# EAGLE design Buffered mult (EAGLE 7.5.0)
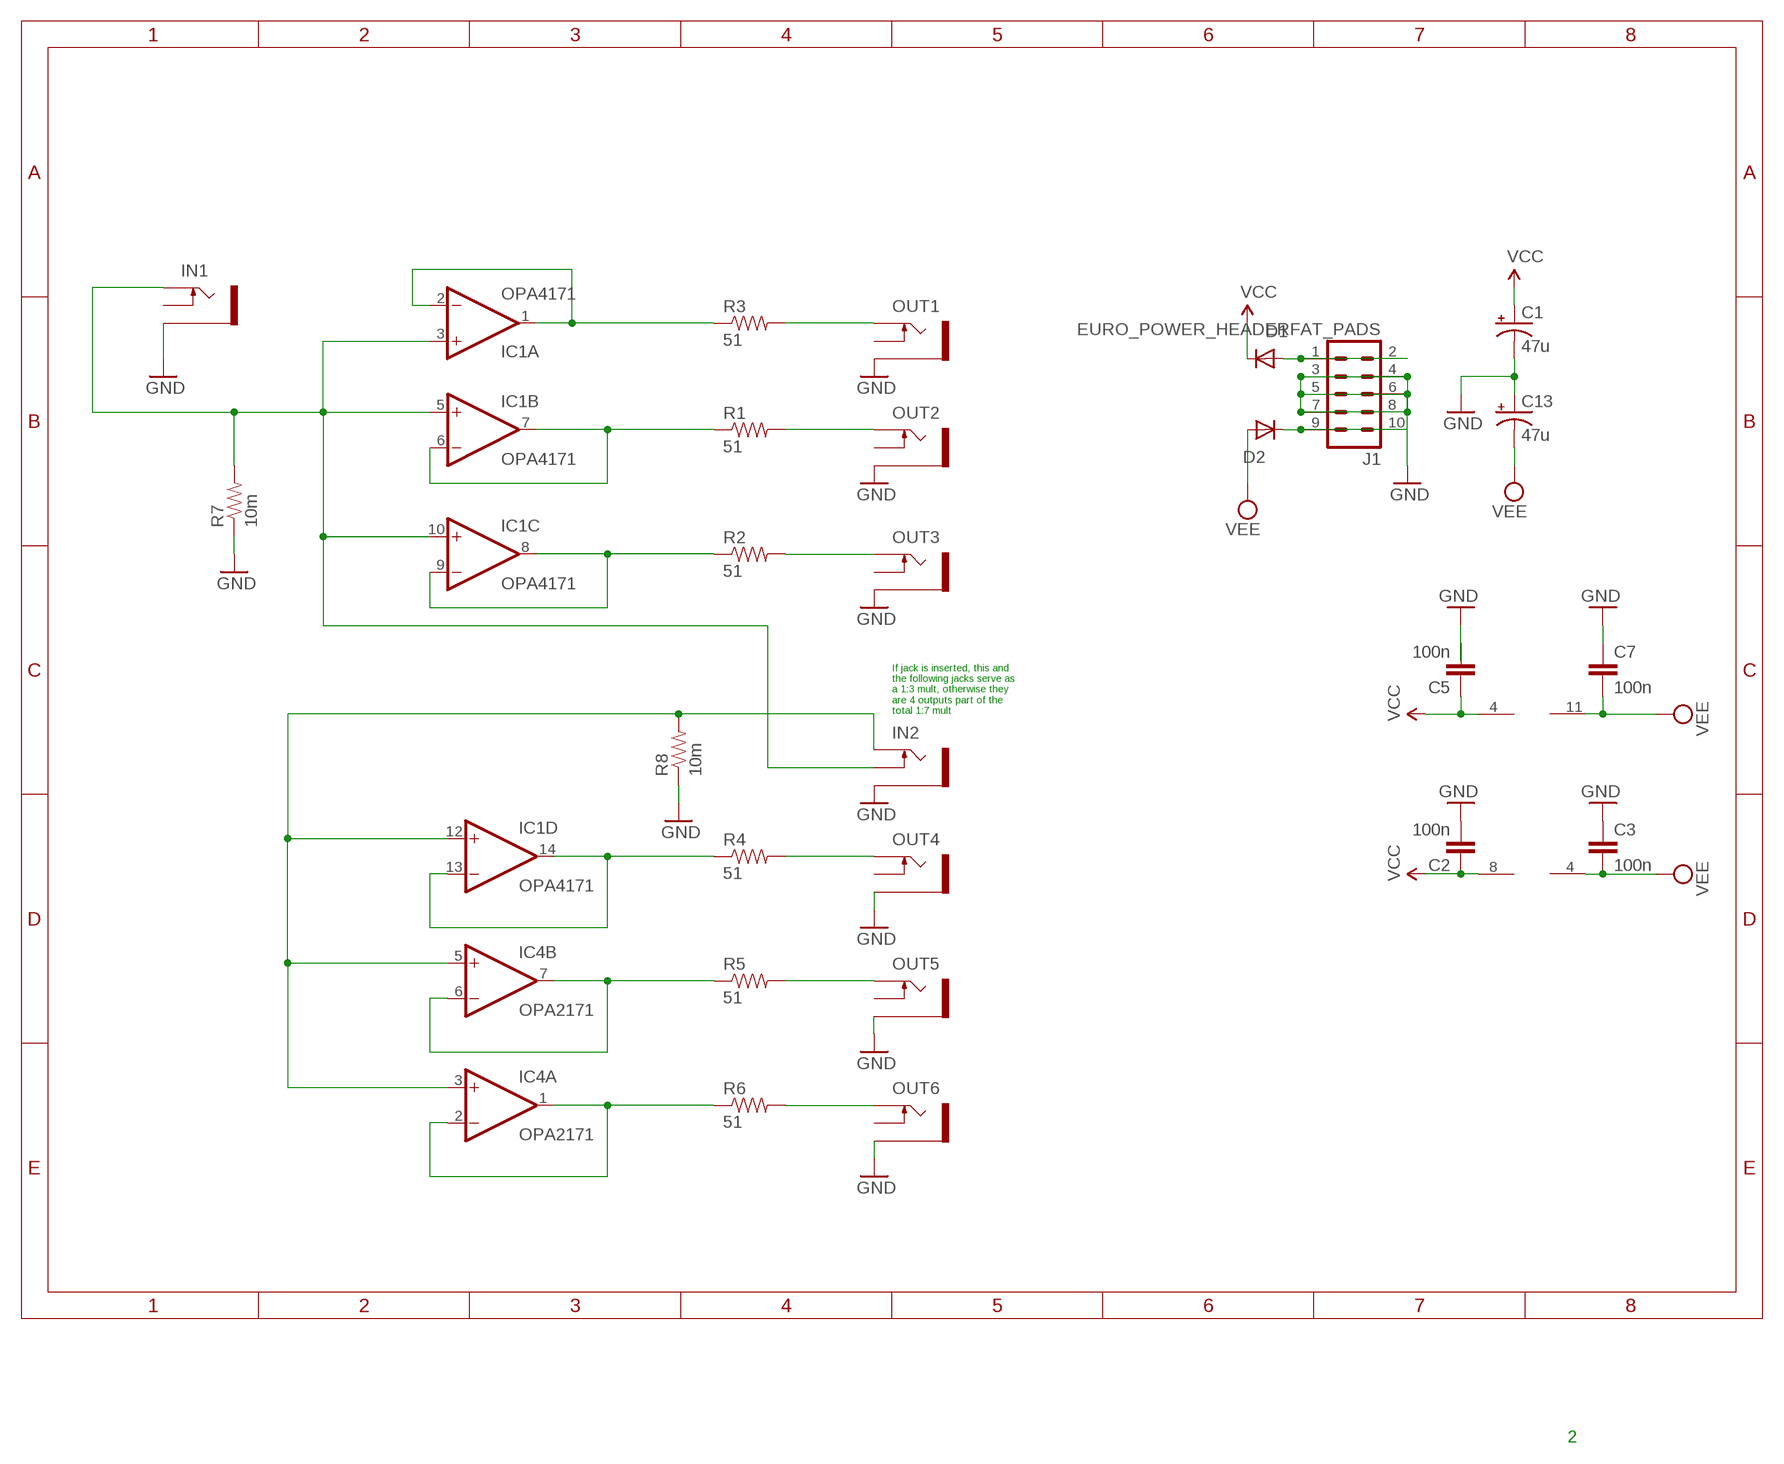
[diagram p0: schematic, sheet 1]

## Parts
C1  47u  CPOL-USD  [PANASONIC_D]
C2  100n  CAP1206  [1206]
C3  100n  CAP1206  [1206]
C5  100n  CAP1206  [1206]
C7  100n  CAP1206  [1206]
C13  47u  CPOL-USD  [PANASONIC_D]
D1  1N5819HW  DIODE-SOD123  [SOD123]
D2  1N5819HW  DIODE-SOD123  [SOD123]
IC1  OPA4171  TL074PW  [TSSOP14]
IC4  OPA2171  TL072D  [SO08]
IN1  PJ302M  [PJ302M]
IN2  PJ302M  [PJ302M]
J1  EURO_POWER_HEADERFAT_PADS  [EURO_PWR_HEADER_FAT]
OUT1  PJ302M  [PJ302M]
OUT2  PJ302M  [PJ302M]
OUT3  PJ302M  [PJ302M]
OUT4  PJ302M  [PJ302M]
OUT5  PJ302M  [PJ302M]
OUT6  PJ302M  [PJ302M]
R1  51  RESISTOR1206  [1206]
R2  51  RESISTOR1206  [1206]
R3  51  RESISTOR1206  [1206]
R4  51  RESISTOR1206  [1206]
R5  51  RESISTOR1206  [1206]
R6  51  RESISTOR1206  [1206]
R7  10m  RESISTOR1206  [1206]
R8  10m  RESISTOR1206  [1206]

## Nets
GND: C1.- C2.2 C3.1 C5.2 C7.1 C13.+ IN1.GND(SLEEVE) IN2.GND(SLEEVE) J1.3 J1.4 J1.5 J1.6 J1.7 J1.8 OUT1.GND(SLEEVE) OUT2.GND(SLEEVE) OUT3.GND(SLEEVE) OUT4.GND(SLEEVE) OUT5.GND(SLEEVE) OUT6.GND(SLEEVE) R7.1 R8.1
N$1: OUT6.TIP R6.2
N$2: IC1.1(A:OUT) IC1.2(A:-IN) R3.1
N$3: OUT5.TIP R5.2
N$4: OUT4.TIP R4.2
N$5: IC1.3(A:+IN) IC1.5(B:+IN) IC1.10(C:+IN) IN1.TIP IN2.SW(SWITCH) R7.2
N$6: IC1.8(C:OUT) IC1.9(C:-IN) R2.1
N$7: OUT2.TIP R1.2
N$8: OUT3.TIP R2.2
N$9: OUT1.TIP R3.2
N$10: IC1.6(B:-IN) IC1.7(B:OUT) R1.1
N$12: IC4.1(A:OUT) IC4.2(A:-IN) R6.1
N$13: IC4.6(B:-IN) IC4.7(B:OUT) R5.1
N$14: D2.C J1.9 J1.10
N$15: D1.A J1.1 J1.2
N$17: IC1.13(D:-IN) IC1.14(D:OUT) R4.1
N$19: IC1.12(D:+IN) IC4.3(A:+IN) IC4.5(B:+IN) IN2.TIP R8.2
VCC: C1.+ C2.1 C5.1 D1.C IC1.4(P:V+) IC4.8(P:V+)
VEE: C3.2 C7.2 C13.- D2.A IC1.11(P:V-) IC4.4(P:V-)
Unconnected: IN1.SW(SWITCH) OUT1.SW(SWITCH) OUT2.SW(SWITCH) OUT3.SW(SWITCH) OUT4.SW(SWITCH) OUT5.SW(SWITCH) OUT6.SW(SWITCH)

## Notes on the sheet
- If jack is inserted, this and 
  the following jacks serve as 
  a 1:3 mult, otherwise they 
  are 4 outputs part of the 
  total 1:7 mult
- 2

## Library data of the parts
C1 C13 = rcl:CPOL-US: POLARIZED CAPACITOR, American symbol
C2 C3 C5 C7 = SparkFun-Capacitors:CAP: Capacitor Standard 0603 ceramic capacitor, and 0.1" leaded capacitor.
D1 D2 = diode:DIODE-: DIODE
IC1 = linear:TL074: OP AMP
IC4 = linear:TL072: OP AMP
IN1 IN2 OUT1-OUT6 = pj302m:PJ302M: PJ302M horizontal / right angled mount 3.5 mm jack socket
J1 = MusicThingModular:EURO_POWER_HEADER: Power Header 10 pin power header for Eurorack Power Supplies Variants with fatter pads for easier soldering, and the LOCK variant which has 5mil offset pins to hold the component in place before soldering
R1-R8 = SparkFun-Passives:RESISTOR: Resistor Basic schematic elements and footprints for 0603, 1206, and PTH resistors.

## Board
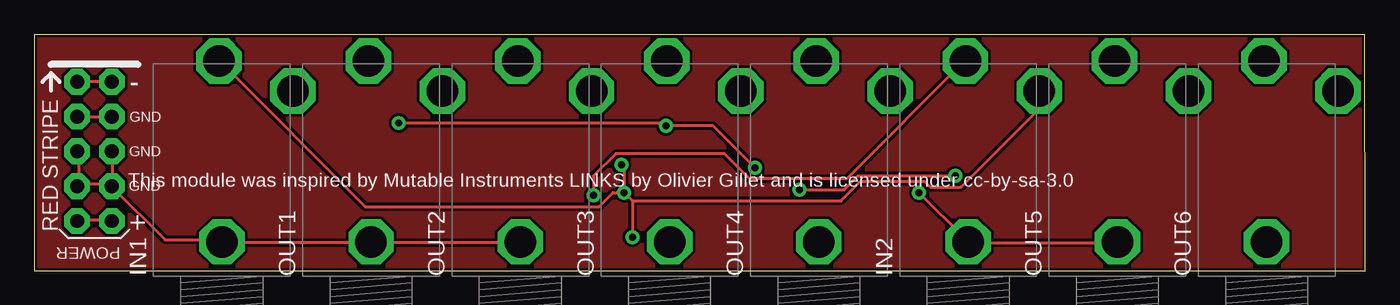
[diagram p1: board, top side]
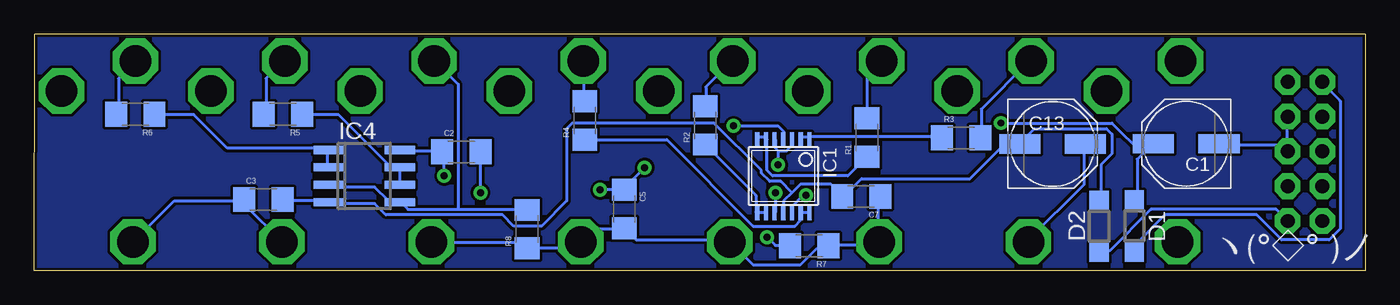
[diagram p2: board, bottom side, seen from below]

Size 97.2 x 17.25 mm. Coordinates in mm from the lower left corner, seen from the top.
Outline: 97.17,17.25 97.2,0 0,0 0,17.25 97.17,17.25
Outline: 97.17,17.25 97.17,17.24
Copper layers (1*16): Top 0.035mm / dielectric 1.5mm / Bottom 0.035mm
Design rules "SparkFun": minimum track width 8mil, minimum drill 20mil, track to track 8mil, track to pad 8mil, pad to pad 8mil, via to via 8mil, smd to smd 8mil, copper to edge 8mil, drill to drill 8mil, minimum pad ring 12mil, minimum via ring 10mil, stop-mask expansion 4mil, vias tented up to drill 20mil, thermal gap 10mil

### Footprints (pad centres in the part's own frame; a part is rotated, then mirrored left to right if it is on the bottom)
PANASONIC_D = smd 3 x 1.4: + 2.4,0; - -2.4,0
1206 = smd 1.6 x 1.8: 1 -1.4,0; 2 1.4,0
SOD123 = smd 1.4 x 1.4: A 1.9,0; C -1.9,0
TSSOP14 = smd 0.305 x 0.991: 1 -1.905,-2.718; 2 -1.27,-2.718; 3 -0.635,-2.718; 4 0,-2.718; 5 0.635,-2.718; 6 1.27,-2.718; 7 1.905,-2.718; 8 1.905,2.718; 9 1.27,2.718; 10 0.635,2.718; 11 0,2.718; 12 -0.635,2.718; 13 -1.27,2.718; 14 -1.905,2.718
SO08 = smd 0.6 x 2.2: 1 -1.905,-2.6; 2 -0.635,-2.6; 3 0.635,-2.6; 4 1.905,-2.6; 5 1.905,2.6; 6 0.635,2.6; 7 -0.635,2.6; 8 -1.905,2.6
PJ302M = drill 2.3 pad 3.3 octagon: GND 2.5,0; SW 13.5,-5.2; TIP 15.7,0.2
EURO_PWR_HEADER_FAT = drill 1.016 pad 1.88 octagon: 1 -5.08,-1.27; 2 -5.08,1.27; 3 -2.54,-1.27; 4 -2.54,1.27; 5 0,-1.27; 6 0,1.27; 7 2.54,-1.27; 8 2.54,1.27; 9 5.08,-1.27; 10 5.08,1.27

### Placement (x,y rotation side)
C1  13.08,9.26 180 bottom
C2  66.01,8.67 0 bottom
C3  80.46,5.19 0 bottom
C5  54.1,4.5 270 bottom
C7  36.8,5.4 180 bottom
C13  22.83,9.24 0 bottom
D1  16.86,3.26 270 bottom
D2  19.44,3.24 90 bottom
IC1  42.5,6.9 180 bottom
IC4  73.1,6.9 270 bottom
IN1  13.7,-0.4 90 top
IN2  68.2,-0.4 90 top
J1  4.4,8.7 270 top
OUT1  24.6,-0.4 90 top
OUT2  35.5,-0.4 90 top
OUT3  46.4,-0.4 90 top
OUT4  57.3,-0.4 90 top
OUT5  79.1,-0.4 90 top
OUT6  90,-0.4 90 top
R1  36.39,9.72 90 bottom
R2  48.19,10.6 90 bottom
R3  29.52,9.69 0 bottom
R4  56.99,10.96 90 bottom
R5  79.04,11.41 180 bottom
R6  89.82,11.41 180 bottom
R7  40.6,1.81 180 bottom
R8  61.21,3.02 90 bottom

### Tracks (layer width: path | path; a pad name or v marks a point on that pad's centre or on a via)
GND  (via drill 0.51)
  Top 0.203: J1.3 3.25,11.18 5.49,11.18 J1.4 | 3.25,6.3 3.25,8.53 J1.5 | J1.8 5.69,6.3 5.69,8.53 J1.6 | 3.25,6.3 5.49,6.3 J1.8 | 3.25,6.3 J1.7 | J1.8 5.69,6.1 9.55,2.23 13.61,2.23 IN1.GND 13.82,2.03 24.59,2.03 OUT1.GND 24.79,2.03 35.36,2.03 OUT2.GND | v64.62,5.69 68.07,2.23 IN2.GND 68.28,2.03 79.05,2.03 OUT5.GND
  Bottom 0.203: 6.1,9.14 10.57,9.14 C1.- | 6.1,9.14 5.69,8.74 J1.6 6.1,9.14 | 6.1,9.14 5.69,9.55 5.69,11.18 J1.4 | OUT5.GND 79.25,2.23 81.69,4.67 81.69,5.08 C3.1 81.89,5.08 86.97,5.08 89.81,2.23 OUT6.GND | C13.+ 20.52,9.14 20.52,6.3 24.59,2.23 OUT1.GND | v64.62,5.69 64.62,8.53 C2.2 | C7.1 35.56,5.28 35.56,2.23 OUT2.GND 35.56,2.03 35.76,1.83 39.01,1.83 R7.1 39.22,1.63 40.03,1.63 41.25,0.41 44.7,0.41 46.33,2.03 OUT3.GND 46.53,2.23 53.24,2.23 54.05,3.05 C5.2 54.25,3.05 56.29,3.05 57.1,2.23 OUT4.GND 57.3,2.03 57.71,1.63 61.16,1.63 R8.1 61.37,1.63 61.77,2.03 68.07,2.03 IN2.GND
N$1
  Bottom 0.203: R6.2 91.03,11.58 91.03,14.02 89.81,15.24 OUT6.TIP
N$2
  Bottom 0.203: 40.64,9.75 41.25,9.75 IC1.2 | 40.64,9.75 31.09,9.75 R3.1 | 40.64,9.75 IC1.1
N$3
  Bottom 0.203: R5.2 80.26,11.58 80.26,14.02 79.05,15.24 OUT5.TIP
N$4
  Bottom 0.203: R4.2 57.1,12.39 57.1,15.24 OUT4.TIP
N$5  (via drill 0.51)
  Top 0.203: v43.08,5.69 43.08,7.52 v42.88,7.72 | 43.69,5.08 v43.69,2.44 | v43.08,5.69 43.69,5.08 | v43.08,5.69 42.27,5.69 41.25,4.67 24.18,4.67 13.61,15.24 IN1.TIP | 43.69,5.08 58.93,5.08 60.35,6.5 65.02,6.5 65.43,6.1 67.67,6.1 73.36,11.79 73.36,13.01 IN2.SW
  Bottom 0.203: v43.08,5.69 43.08,4.27 IC1.10 | 42.88,8.74 v42.88,7.72 | 42.88,8.74 43.08,8.94 43.08,9.55 IC1.5 | 42.88,8.74 42.27,8.74 41.86,9.14 41.86,9.55 IC1.3 | v43.69,2.44 43.08,1.83 42.06,1.83 R7.2
N$6
  Bottom 0.203: IC1.9 43.89,4.27 44.3,4.27 IC1.8 44.5,4.27 44.5,5.49 48.16,9.14 R2.1
N$7
  Bottom 0.203: R1.2 36.37,11.18 36.37,14.22 35.36,15.24 OUT2.TIP
N$8
  Bottom 0.203: R2.2 48.16,12.19 48.16,13.41 46.33,15.24 OUT3.TIP
N$9
  Bottom 0.203: R3.2 28.04,9.75 28.04,11.79 24.59,15.24 OUT1.TIP
N$10
  Bottom 0.203: IC1.7 44.3,9.75 43.89,9.75 IC1.6 43.69,9.55 43.69,7.32 43.28,6.91 37.8,6.91 36.58,8.13 R1.1
N$11
  pour Bottom: 0.1,17.2 0.1,0 97.2,0 97.2,17.2
N$12
  Bottom 0.203: R6.1 88.39,11.38 85.55,11.38 83.11,8.94 75.79,8.94 IC4.1 75.79,8.74 75.79,7.72 IC4.2
N$13
  Bottom 0.203: R5.1 77.62,11.38 74.98,11.38 71.32,7.72 70.51,7.72 IC4.7 70.51,7.52 70.51,6.3 IC4.6
N$14
  Top 0.203: J1.9 3.25,3.66 5.49,3.66 J1.10
  Bottom 0.203: D2.C 19.3,1.42 18.69,1.42 15.65,4.47 6.5,4.47 5.69,3.66 J1.10
N$15
  Top 0.203: J1.2 5.49,13.82 3.25,13.82 J1.1
  Bottom 0.203: D1.A 16.66,1.42 16.66,2.03 14.63,4.06 7.92,4.06 6.1,2.23 2.64,2.23 1.83,3.05 1.83,12.39 3.05,13.61 J1.1
N$16
  pour Top: 0,17.2 97.4,17.2 97.5,0 0.1,0
N$17
  Bottom 0.203: IC1.14 40.64,4.27 41.25,4.27 IC1.13 41.25,4.06 41.25,3.66 41.66,3.25 44.7,3.25 51,9.55 56.9,9.55 R4.1
N$19  (via drill 0.51)
  Top 0.203: v40.84,5.49 40.84,6.91 42.47,8.53 50.39,8.53 52.22,6.71 59.33,6.71 67.87,15.24 IN2.TIP
  Bottom 0.203: 66.24,4.47 69.9,4.47 70.31,4.88 IC4.5 70.51,5.08 71.32,5.08 72.34,6.1 75.59,6.1 IC4.3 | 66.24,4.47 61.37,4.47 R8.2 | v40.84,5.49 41.05,5.49 41.86,4.67 41.86,4.27 IC1.12 | 66.24,4.47 66.24,13.61 67.87,15.24 IN2.TIP
VCC  (via drill 0.51)
  Top 0.203: v52.63,7.52 49.58,10.57 v46.13,10.57 45.92,10.77 v26.62,10.77 | v67.26,6.91 60.15,6.91 59.13,5.89 v55.88,5.89
  Bottom 0.203: 16.26,8.53 15.65,9.14 C1.+ | 16.26,8.53 16.66,8.13 16.66,5.28 D1.C | IC4.8 70.31,8.74 67.46,8.74 C2.1 67.26,8.53 v67.26,6.91 | v46.13,10.57 42.88,10.57 42.47,10.16 42.47,9.75 IC1.4 | v52.63,7.52 54.05,6.1 C5.1 54.25,5.89 v55.88,5.89 | 16.26,8.53 18.49,10.77 v26.62,10.77
VEE
  Bottom 0.203: D2.A 19.3,5.28 19.3,7.72 18.49,8.53 18.49,9.96 18.9,10.36 24.18,10.36 25.2,9.35 C13.- 25.4,9.14 26.42,9.14 28.85,6.71 36.78,6.71 38,5.49 C7.2 38.2,5.49 39.01,6.3 41.25,6.3 41.86,5.69 | C3.2 79.05,5.08 75.79,5.08 IC4.4 75.59,4.88 72.34,4.88 71.53,4.06 62.99,4.06 62.18,3.25 60.15,3.25 58.32,5.08 58.32,10.36 57.91,10.77 47.55,10.77 44.09,7.32 44.09,7.11 43.48,6.5 42.67,6.5 41.86,5.69 | 41.86,5.69 42.47,5.08 42.47,4.27 IC1.11

### Text on the board
tNames: This module was inspired by Mutable Instruments LINKS by Olivier Gillet and is licensed under cc-by-sa-3.0 | ༼ ͒ ̶ ͒༽
bNames: ༼ ͒ ̶ ͒༽ | ༼ ͒ ̶ ͒༽ | ༼ ͒ ͓ ͒༽ | ヽ(°◇° )ノ | ༼ ͒ ͓ ͒༽